# EAGLE design Metronome (EAGLE 9.6.2)
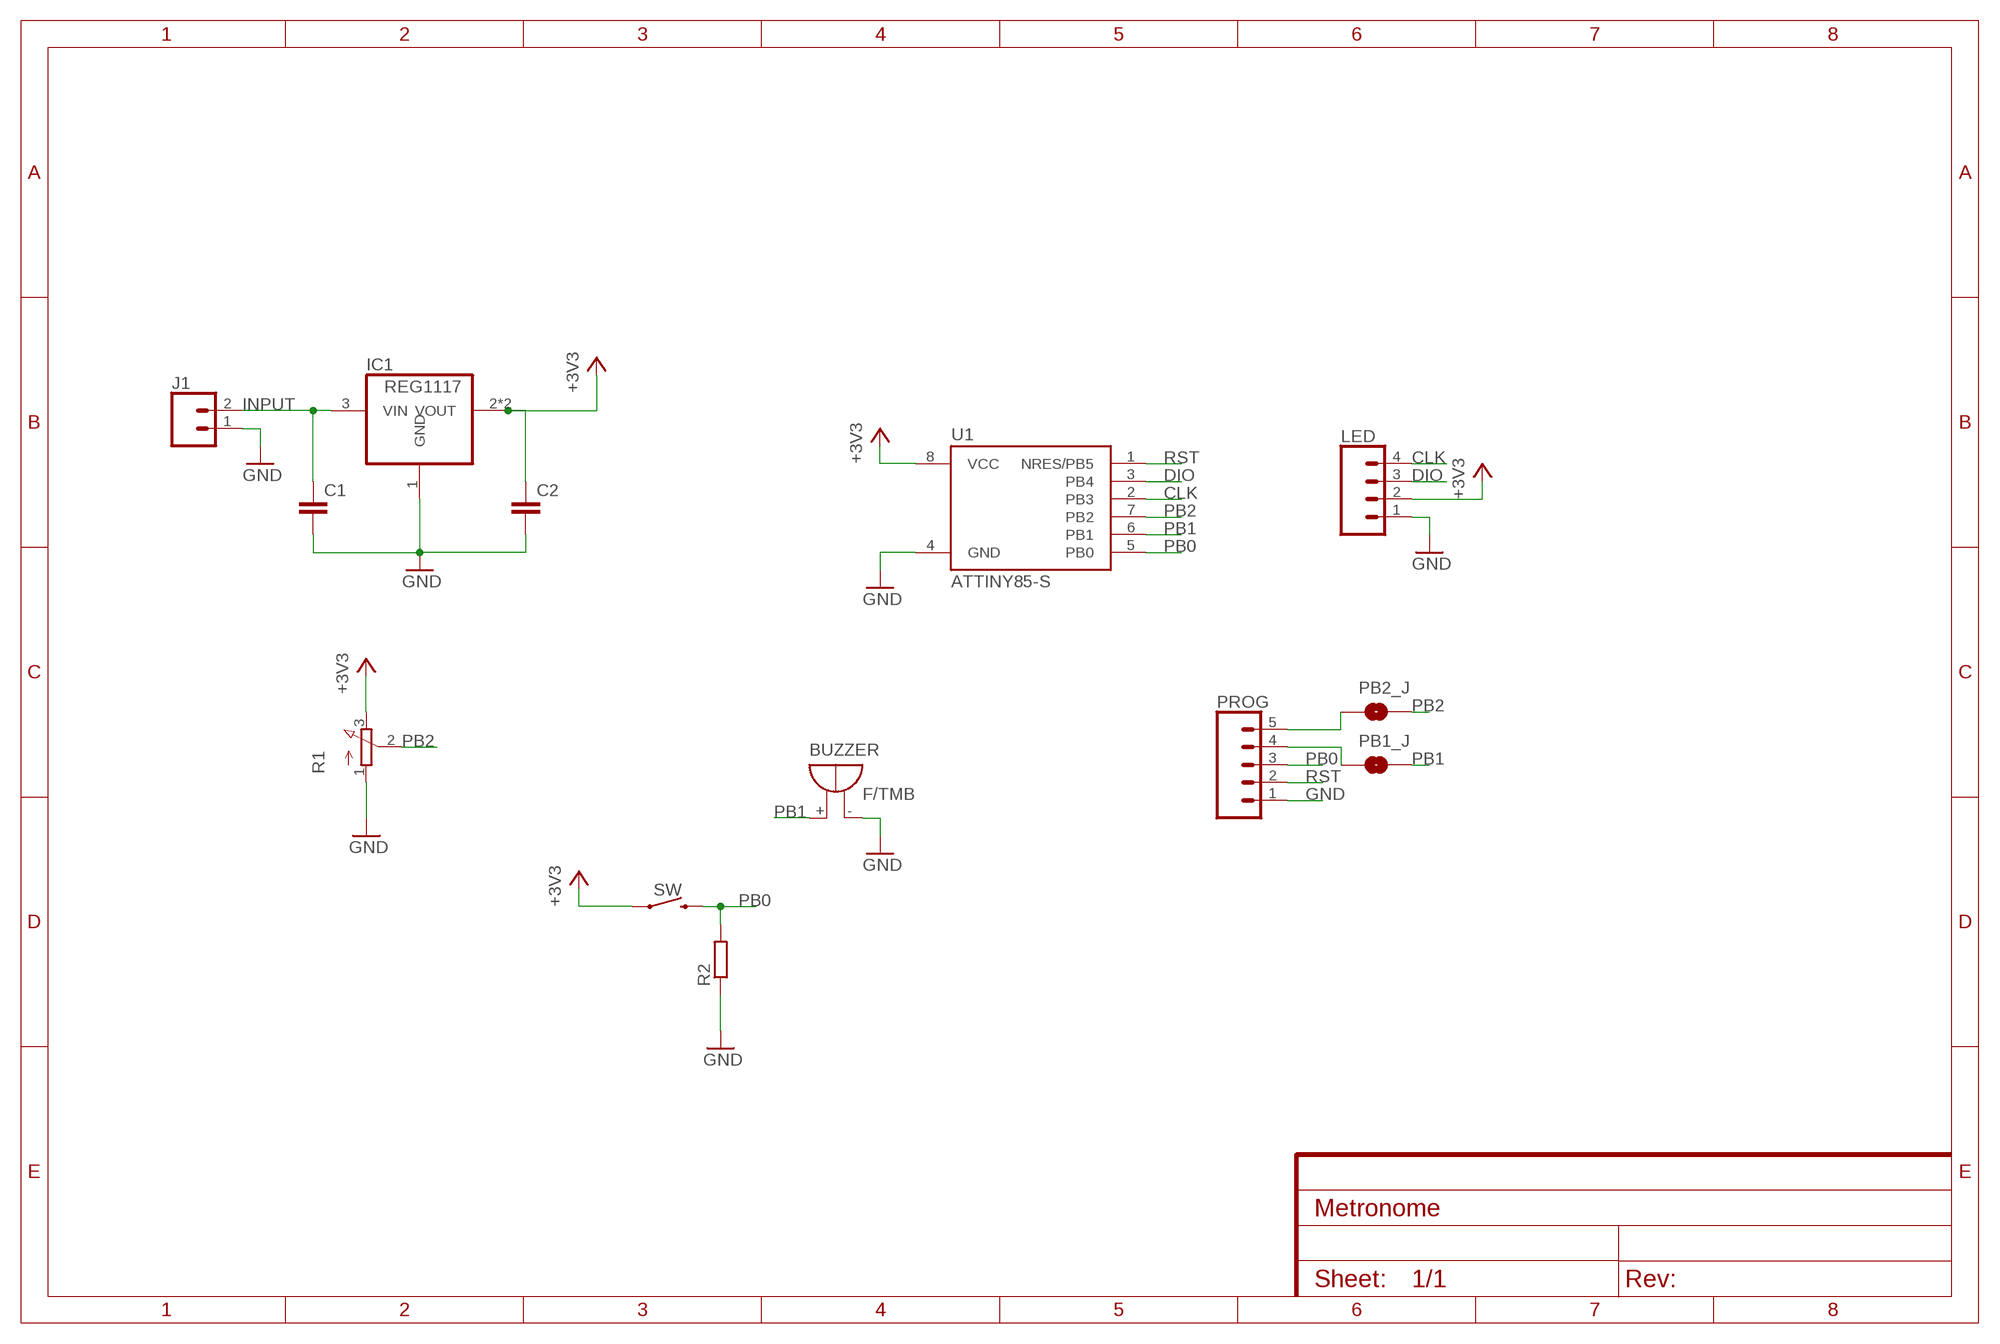
[diagram p0: schematic, sheet 1]

## Parts
BUZZER  F/TMB  [F/TMB]
C1  C-EUC1206  [C1206]
C2  C-EUC1206  [C1206]
IC1  REG1117  [SOT223]
J1  CONN_02POLAR  [MOLEX-1X2]
LED  CONN_04  [1X04]
PB1_J  JUMPER-SMT_2_NO_NO-SILK  [SMT-JUMPER_2_NO_NO-SILK]
PB2_J  JUMPER-SMT_2_NO_NO-SILK  [SMT-JUMPER_2_NO_NO-SILK]
PROG  CONN_05  [1X05]
R1  3RP/1610N  [3RP/1610N]
R2  R-EU_R1206  [R1206]
SW  MOMENTARY-SWITCH-SPST-PTH-12MM  [TACTILE_SWITCH_PTH_12MM]
U1  ATTINY85-S  [SOIC8_EIAJ_208MIL]

## Nets
+3V3: C2.1 IC1.2(VOUT) IC1.4(VOUT) LED.2 R1.3(E) SW.1 U1.8(VCC)
CLK: LED.4 U1.2(PB3)
DIO: LED.3 U1.3(PB4)
GND: BUZZER.- C1.2 C2.2 IC1.1(GND) J1.1 LED.1 PROG.1 R1.1(A) R2.1 U1.4(GND)
INPUT: C1.1 IC1.3(VIN) J1.2
N$2: PB2_J.1 PROG.5
N$3: PB1_J.1 PROG.4
PB0: PROG.3 R2.2 SW.3 U1.5(PB0)
PB1: BUZZER.+ PB1_J.2 U1.6(PB1)
PB2: PB2_J.2 R1.2(S) U1.7(PB2)
RST: PROG.2 U1.1(NRES/PB5)

## Library data of the parts
BUZZER = buzzer:F/TMB: BUZZER Source: Buerklin; OC_FARNELL: unknown; OC_NEWARK: unknown
C1 C2 = rcl:C-EU: CAPACITOR, European symbol; SPICEPREFIX: C
IC1 = vref_mod:REG1117: 800mA and 1A Low Dropout (LDO) Positive Regulator 1.8V, 2.5V, 2.85V, 3.3V, 5V, and Adj; MPN: REG1117; OC_FARNELL: 1097566; OC_NEWARK: 14P6981
J1 = SparkFun-Connectors:CONN_02: Multi connection point. Often used as Generic Header-pin footprint for 0.1 inch spaced/style header connections On any of the 0.1 inch spaced packages, you can populate with these: Break Away Headers - Straight <https://www.sparkfun.com/products/116> (PRT-00116) Break Away Male Headers - Right Angle <https://www.sparkfun.com/products/553> (PRT-00553) Female Headers <https://www.sparkfun.com/products/115> (PRT-00115) Break Away Headers - Machine Pin <https://www.sparkfun.com/products/117> (PRT-00117) Break Away Female Headers - Swiss Machine Pin <https://www.sparkfun.com/products/743> (PRT-00743) For SCREWTERMINALS and SPRING TERMINALS visit here: Screw Terimnals on SparkFun.com <https://www.sparkfun.com/search/results?term=Screw+Terminals> (5mm/3.5mm/2.54mm spacing) This device is also useful as a general connection point to wire up your design to another part of your project. Our various solder wires solder well into these plated through hole pads. Hook-Up Wire - Assortment (Stranded, 22 AWG) <https://www.sparkfun.com/products/11375> (PRT-11375) Hook-Up Wire - Assortment (Solid Core, 22 AWG) <https://www.sparkfun.com/products/11367> (PRT-11367) View the entire wire category on our website here <https://www.sparkfun.com/categories/141> Special notes: Molex polarized connector foot print use with: PRT-08233 with associated crimp pins and housings. 2.54_SCREWTERM for use with PRT-10571. 3.5mm Screw Terminal footprints for PRT-08084 5mm Screw Terminal footprints for use with PRT-08432; SF_ID: PRT-09918
LED = SparkFun-Connectors:CONN_04: Multi connection point. Often used as Generic Header-pin footprint for 0.1 inch spaced/style header connections On any of the 0.1 inch spaced packages, you can populate with these: Break Away Headers - Straight <https://www.sparkfun.com/products/116> (PRT-00116) Break Away Male Headers - Right Angle <https://www.sparkfun.com/products/553> (PRT-00553) Female Headers <https://www.sparkfun.com/products/115> (PRT-00115) Break Away Headers - Machine Pin <https://www.sparkfun.com/products/117> (PRT-00117) Break Away Female Headers - Swiss Machine Pin <https://www.sparkfun.com/products/743> (PRT-00743) For SCREWTERMINALS and SPRING TERMINALS visit here: Screw Terimnals on SparkFun.com <https://www.sparkfun.com/search/results?term=Screw+Terminals> (5mm/3.5mm/2.54mm spacing) This device is also useful as a general connection point to wire up your design to another part of your project. Our various solder wires solder well into these plated through hole pads. Hook-Up Wire - Assortment (Stranded, 22 AWG) <https://www.sparkfun.com/products/11375> (PRT-11375) Hook-Up Wire - Assortment (Solid Core, 22 AWG) <https://www.sparkfun.com/products/11367> (PRT-11367) View the entire wire category on our website here <https://www.sparkfun.com/categories/141> Special notes: Molex polarized connector foot print use with SKU : PRT-08231 with associated crimp pins and housings. 1MM SMD Version SKU: PRT-10208; PROD_ID: CONN-09696
PB1_J PB2_J = SparkFun-Jumpers:JUMPER-SMT_2_NO: Normally open jumper This jumper has two pads in close proximity to each other. Apply solder to close the connection. Round pads are easier to solder for beginners, but are a lot larger. SparkFun Product that uses the round pads: SparkFun EL Sequencer <https://www.sparkfun.com/products/12781>
PROG = SparkFun-Connectors:CONN_05: Multi connection point. Often used as Generic Header-pin footprint for 0.1 inch spaced/style header connections On any of the 0.1 inch spaced packages, you can populate with these: Break Away Headers - Straight <https://www.sparkfun.com/products/116> (PRT-00116) Break Away Male Headers - Right Angle <https://www.sparkfun.com/products/553> (PRT-00553) Female Headers <https://www.sparkfun.com/products/115> (PRT-00115) Break Away Headers - Machine Pin <https://www.sparkfun.com/products/117> (PRT-00117) Break Away Female Headers - Swiss Machine Pin <https://www.sparkfun.com/products/743> (PRT-00743) For SCREWTERMINALS and SPRING TERMINALS visit here: Screw Terimnals on SparkFun.com <https://www.sparkfun.com/search/results?term=Screw+Terminals> (5mm/3.5mm/2.54mm spacing) This device is also useful as a general connection point to wire up your design to another part of your project. Our various solder wires solder well into these plated through hole pads. Hook-Up Wire - Assortment (Stranded, 22 AWG) <https://www.sparkfun.com/products/11375> (PRT-11375) Hook-Up Wire - Assortment (Solid Core, 22 AWG) <https://www.sparkfun.com/products/11367> (PRT-11367) View the entire wire category on our website here <https://www.sparkfun.com/categories/141> Special notes: Molex polarized connector foot print use with SKU : PRT-08231 with associated crimp pins and housings. 1MM SMD Version SKU: PRT-10208
R1 = pot:3RP/1610N: 16mm Potentiometer one level Source: http://www.alphapotentiometers.net/html/16mm_pot_2.html
R2 = rcl:R-EU_: RESISTOR, European symbol; SPICEPREFIX: R
SW = SparkFun-Switches:MOMENTARY-SWITCH-SPST: Momentary Switch (Pushbutton) - SPST Normally-open (NO) SPST momentary switches (buttons, pushbuttons). Variants PTH-12MM - 12mm square, through-hole Momentary Pushbutton Switch - 12mm Square <https://www.sparkfun.com/products/9190> (COM-09190) PTH-6.0MM, PTH-6.0MM-KIT - 6.0mm square, through-hole Mini Pushbutton Switch <https://www.sparkfun.com/products/97> (COM-00097) KIT package intended for soldering kit's - only one side of pads' copper is exposed. PTH-RIGHT-ANGLE-KIT - Right-angle, through-hole Right Angle Tactile Button <https://www.sparkfun.com/products/10791> - Used on SparkFun BigTime Watch Kit <https://www.sparkfun.com/products/11734> SMD-12MM - 12mm square, surface-mount Tactile Button - SMD (12mm) <https://www.sparkfun.com/products/12993> (COM-12993) Used on SparkFun PicoBoard <https://www.sparkfun.com/products/11888> SMD-4.5MM - 4.5mm Square Trackball Switch Used on SparkFun Blackberry Trackballer Breakout <https://www.sparkfun.com/products/13169> SMD-4.6MMX2.8MM - 4.60mm x 2.80mm, surface mount Used on SparkFun SAMD21 Mini Breakout <https://www.sparkfun.com/products/13664> SMD-5.2MM, SMD-5.2-REDUNDANT - 5.2mm square, surface-mount Mini Pushbutton Switch - SMD <https://www.sparkfun.com/products/8720> (COM-08720) Used on Arduino Pro Mini <https://www.sparkfun.com/products/11114> REDUNDANT package connects both switch circuits together SMD-6.0X3.5MM - 6.0 x 3.5mm, surface mount Momentary Reset Switch SMD <https://www.sparkfun.com/products/8229> (COM-08229) SMD-6.2MM-TALL - 6.2mm square, surface mount Tactile Button - SMD (6mm) <https://www.sparkfun.com/products/12992> Used on SparkFun Digital Sandbox <https://www.sparkfun.com/products/12651> SMD-RIGHT-ANGLE - Right-angle, surface mount Used on SparkFun Block for Intel® Edison - Arduino <https://www.sparkfun.com/products/13036>; PROD_ID: SWCH-09185; SF_SKU: COM-09190
U1 = _hhn_attiny25_45_85:ATTINY85*: ATMEL ATtiny 85 Packages: P = PDIP 08 30mil S = SOIC 08 EIAJ 208mil Technologies Note: for complete ordering code (temp. range, finish, tape&reel etc.) see www.atmel.com • Supply Voltage: V = (1.8…5.5)V | [blank] = (2.7…5.5)V • Speed: 10 = 10 MHz | 20 = 20 MHz Author: Dipl.-Ing. FH Rainer Bayer HHN Hochschule Heilbronn (Heilbronn University), rainer.bayer@hs-heilbronn.de Ingenieurbüro ing-rb, mail@ing-rb.de

## Board
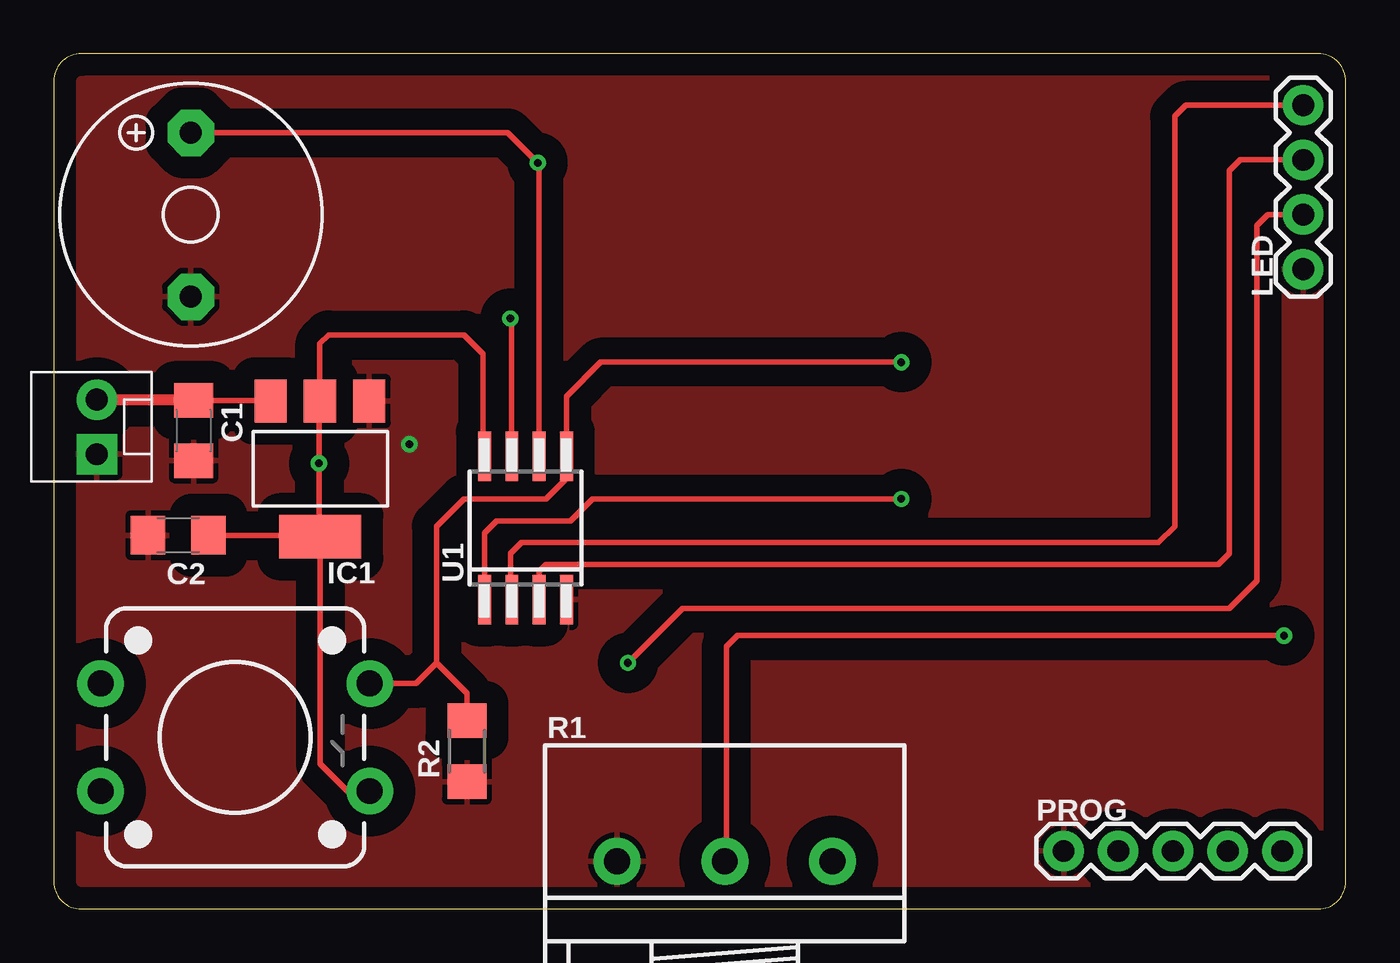
[diagram p1: board, top side]
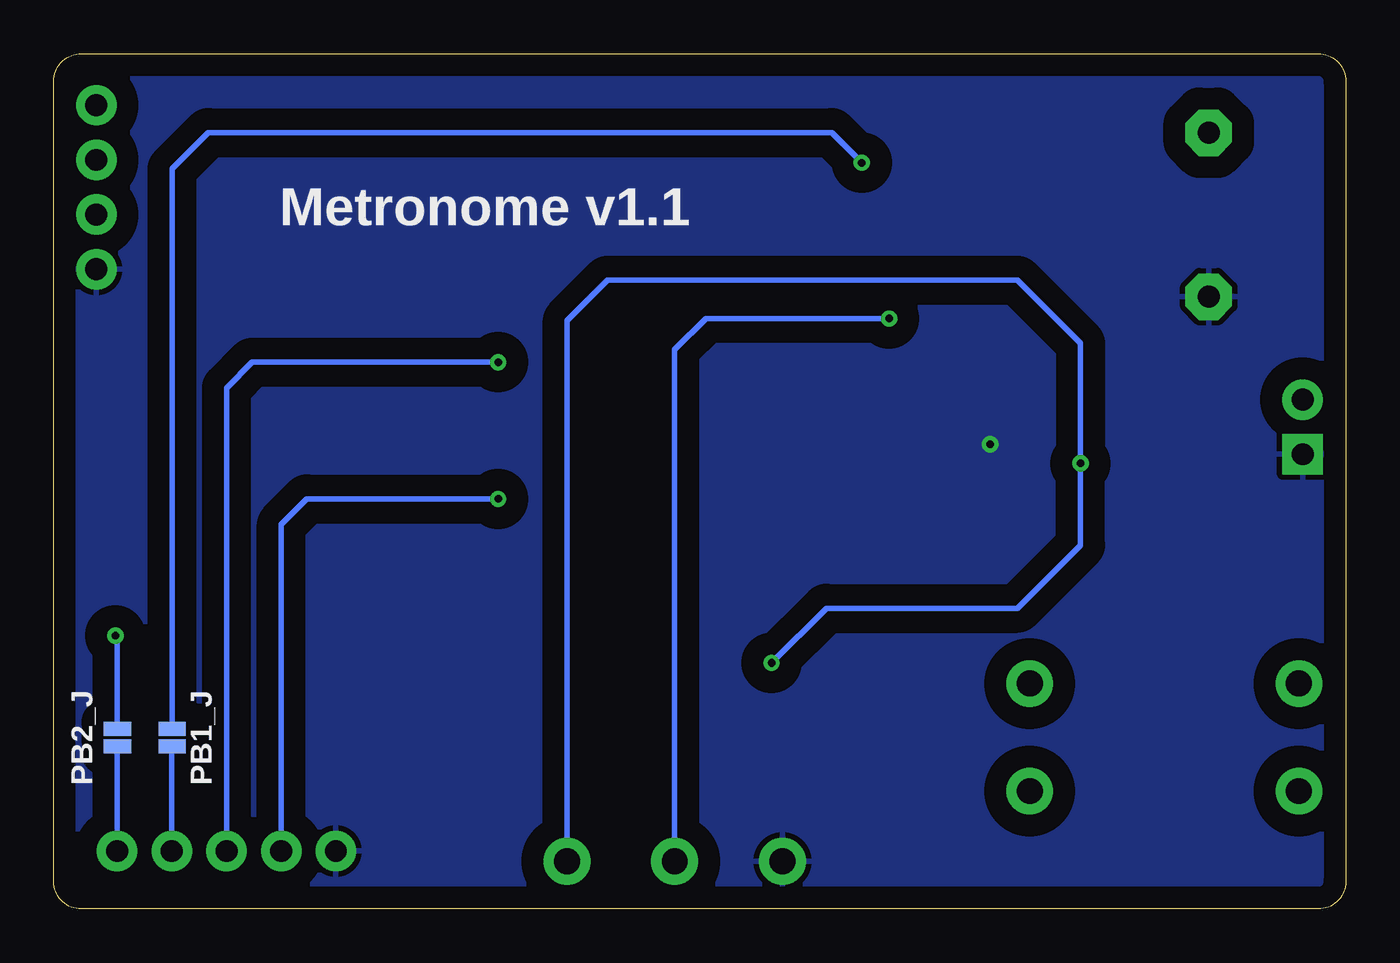
[diagram p2: board, bottom side, seen from below]

Size 60.01 x 39.73 mm. Coordinates in mm from the lower left corner, seen from the top.
Outline: 0,38.46 0,1.27 arc90 1.27,0 58.74,0 arc90 60.01,1.27 60.01,38.46 arc90 58.74,39.73 1.27,39.73 arc90 0,38.46
Copper layers (1*16): Top 0.035mm / dielectric 1.5mm / Bottom 0.035mm
Design rules "default": minimum track width 6mil, minimum drill 0.35mm, track to track 6mil, track to pad 6mil, pad to pad 6mil, via to via 6mil, smd to smd 6mil, copper to edge 40mil, drill to drill 6mil, minimum pad ring 10mil, minimum via ring 8mil, stop-mask expansion 4mil, vias tented up to drill 0mil, thermal gap 10mil

### Footprints (pad centres in the part's own frame; a part is rotated, then mirrored left to right if it is on the bottom)
F/TMB = drill 1.016 pad 2.159 octagon: + 3.81,0; - -3.81,0
C1206 = smd 1.6 x 1.8: 1 -1.4,0; 2 1.4,0
SOT223 = smd 1.499 x 2.007: 1 -2.261,-3.15; 2 0.025,-3.15; 3 2.311,-3.15 | smd 3.81 x 2.007: 4 0,3.15
MOLEX-1X2 = drill 1.016 pad 1.88 square: 1 0,0 | drill 1.016 pad 1.88: 2 2.54,0
1X04 = drill 1.016 pad 1.88: 1 0,0; 2 2.54,0; 3 5.08,0; 4 7.62,0
SMT-JUMPER_2_NO_NO-SILK = smd 0.635 x 1.27: 1 -0.406,0; 2 0.406,0
1X05 = drill 1.016 pad 1.88: 1 0,0; 2 2.54,0; 3 5.08,0; 4 7.62,0; 5 10.16,0
3RP/1610N = drill 1.2 pad 2.184: 1 -5,0; 2 0,0; 3 5,0
R1206 = smd 1.6 x 1.803: 1 -1.422,0; 2 1.422,0
TACTILE_SWITCH_PTH_12MM = drill 1.2 pad 2.159: 1 6.25,-2.5; 2 -6.25,-2.5; 3 6.25,2.5; 4 -6.25,2.5
SOIC8_EIAJ_208MIL = smd 0.6 x 2.286: 1 -1.905,-3.33; 2 -0.635,-3.33; 3 0.635,-3.33; 4 1.905,-3.33; 5 1.905,3.33; 6 0.635,3.33; 7 -0.635,3.33; 8 -1.905,3.33

### Placement (x,y rotation side)
BUZZER  6.37,32.26 90 top
C1  6.49,22.23 270 top
C2  5.78,17.36 180 top
IC1  12.38,20.45 180 top
J1  2,21.13 90 top
LED  58.04,29.72 90 top
PB1_J  54.52,7.96 90 bottom
PB2_J  57.06,7.96 90 bottom
PROG  46.91,2.69 0 top
R1  31.17,2.21 0 top
R2  19.19,7.33 90 top
SW  8.43,7.97 0 top
U1  21.91,17.7 0 top

### Tracks (layer width: path | path; a pad name or v marks a point on that pad's centre or on a via)
+3V3  (via drill 0.35)
  Top 0.254: C2.1 13.53,17.36 13.59,17.3 IC1.4 | LED.2 56.39,32.26 55.88,31.75 55.88,15.24 54.61,13.97 29.21,13.97 v26.67,11.43 | IC1.4 12.32,17.36 v12.32,20.7 12.32,23.56 IC1.2 12.36,26.26 12.76,26.67 19.05,26.67 19.94,25.78 19.94,21.08 19.95,21.08 U1.8 | IC1.4 12.38,6.74 13.65,5.47 SW.1
  Bottom 0.254: R1.3 36.17,27.33 34.29,29.21 15.24,29.21 12.32,26.29 v12.32,20.7 12.32,16.89 15.24,13.97 24.13,13.97 v26.67,11.43
CLK
  Top 0.254: LED.4 52.58,37.34 52.07,36.83 52.07,17.78 51.31,17.02 21.72,17.02 21.21,16.51 21.21,14.44 U1.2
DIO
  Top 0.254: U1.3 22.55,15.69 22.86,16 54.1,16 54.61,16.51 54.61,34.29 55.12,34.8 LED.3
GND  (via drill 0.35)
  other vias: 16.51,21.59
  pour Bottom (isolate 1.016): 59.69,0 0,0 0,39.37 59.69,39.37
  pour Top (isolate 1.016): 0,0 0,37.59 arc-90 1.78,39.37 59.69,39.37 59.69,0
INPUT
  Top 0.254: C1.1 10.04,23.62 IC1.3
  Top 0.508: J1.2 6.45,23.67 C1.1
N$2
  Bottom 0.254: PROG.5 57.07,7.55 PB2_J.1
N$3
  Bottom 0.254: PROG.4 54.53,7.54 PB1_J.1
PB0  (via drill 0.35)
  Top 0.254: 17.78,11.43 17.78,17.78 19.05,19.05 22.86,19.05 23.82,20 U1.5 23.82,23.82 25.4,25.4 v39.37,25.4 | SW.3 16.82,10.47 17.78,11.43 | 17.78,11.43 19.19,10.02 R2.2
  Bottom 0.254: PROG.3 51.99,24.21 50.8,25.4 v39.37,25.4
PB1  (via drill 0.35)
  Top 0.254: BUZZER.+ 21.09,36.06 v22.48,34.67 22.61,34.54 22.55,34.48 U1.6
  Bottom 0.254: PB1_J.2 54.52,34.38 52.83,36.07 23.88,36.07 v22.48,34.67
PB2  (via drill 0.35)
  Top 0.254: U1.7 21.27,27.37 v21.21,27.43 | R1.2 31.24,2.28 31.24,12.19 31.75,12.7 v57.15,12.7
  Bottom 0.254: v21.21,27.43 29.72,27.43 31.17,25.98 R1.2 | PB2_J.2 57.06,12.61 v57.15,12.7
RST  (via drill 0.35)
  Top 0.254: v39.37,19.05 25.02,19.05 24,18.03 20.57,18.03 20,17.46 U1.1
  Bottom 0.254: PROG.2 49.45,17.86 48.26,19.05 v39.37,19.05

### Text on the board
bNames: Metronome v1.1